# Altium schematic sheet 大号发球机.SchDoc
size A3
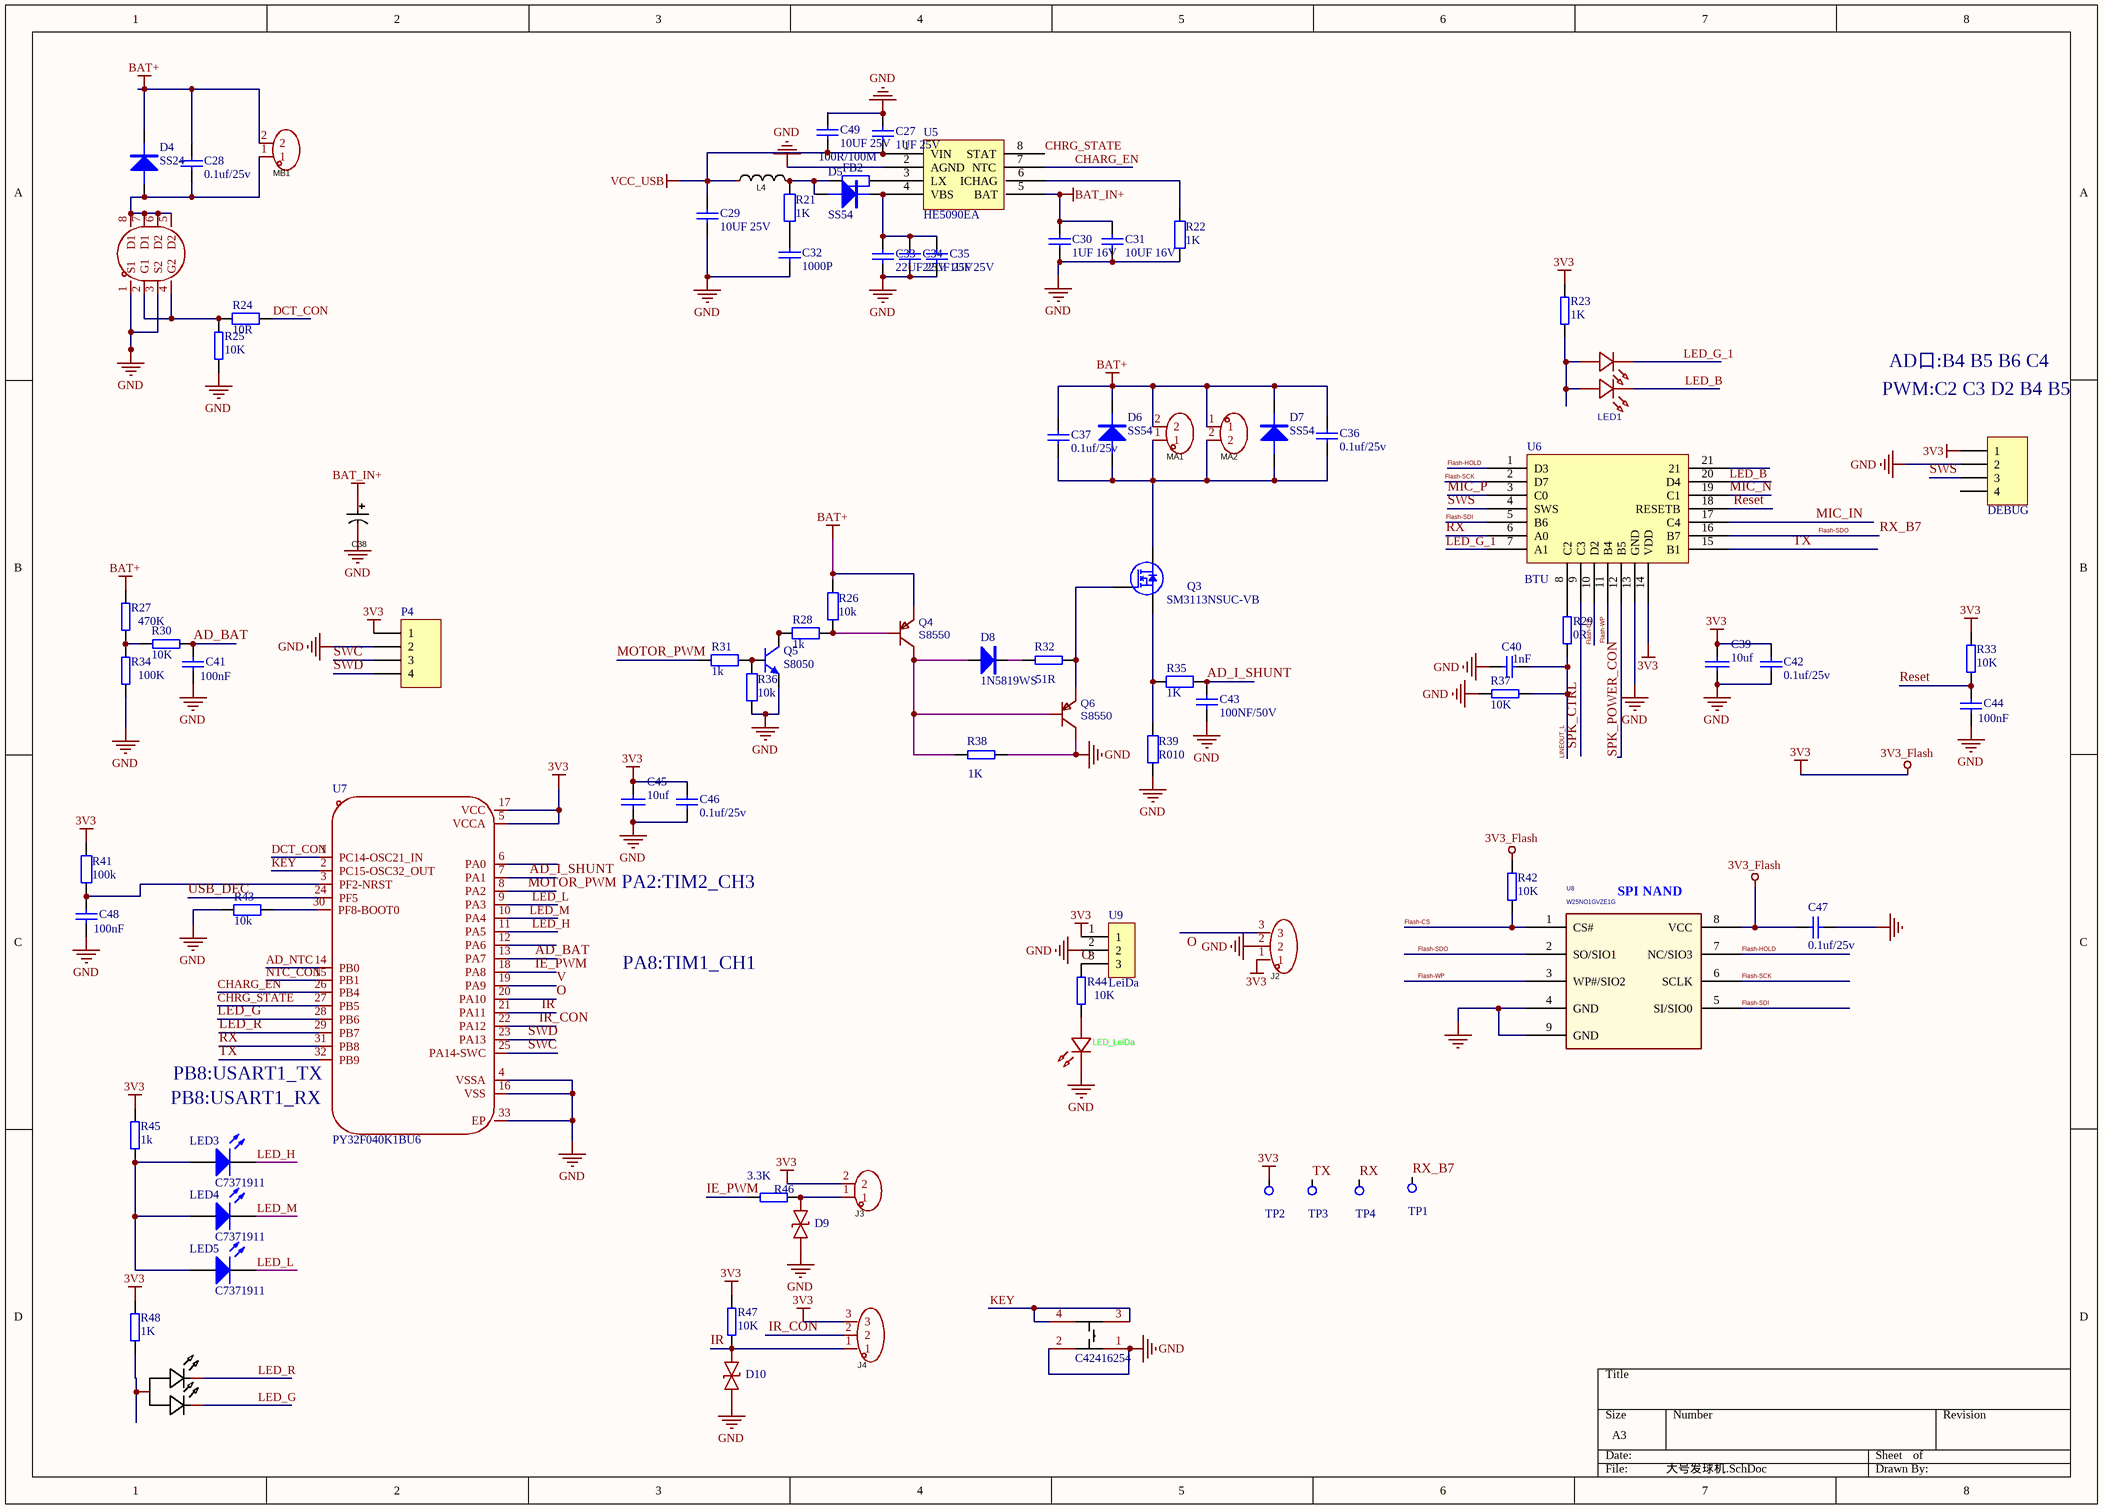
[diagram p0: 大号发球机.SchDoc]

## Parts
C27  1UF 25V  [0603_C]
C28  0.1uf/25v  [0805_C]
C29  10UF 25V  [0603_c]
C30  1UF 16V  [0603_C]
C31  10UF 16V  [0603_c]
C32  1000P  [0603_C]
C33  22UF 25V  [0805_C]
C34  22UF 25V  [0805_C]
C35  1UF 25V  [0603_C]
C36  0.1uf/25v  [0805_C]
C37  0.1uf/25v  [0805_C]
C38  220uf/25v  [SMD 6.3*7.7]  (value not drawn)
C39  10uf  [0603_c]
C40  1nF  [0603_C]
C41  100nF  [0603_C]
C42  0.1uf/25v  [0603_C]
C43  100NF/50V  [0603_C]
C44  100nF  [0603_C]
C45  10uf  [0603_c]
C46  0.1uf/25v  [0603_C]
C47  0.1uf/25v  [0603_C]
C48  100nF  [0603_C]
C49  10UF 25V  [0603_c]
D4  SS24  [SMA]
D5  SS54  [SMA]
D6  SS54  [SMA]
D7  SS54  [SMA]
D8  1N5819WS  [SOD-323]
D9  LESD5Z5.0CT1G  [SOD-523_L1.2-W0.8-LS1.6-RD]  (value not drawn)
D10  LESD5Z5.0CT1G  [SOD-523_L1.2-W0.8-LS1.6-RD]  (value not drawn)
FB2  100R/100M  [0805_R]
J2  2.0-3P LT  [CONN-SMD_2.0-3PLT]  (value not drawn)
J3  2.54-2P LT  [CONN-SMD_2.54-2PLT]  (value not drawn)
J4  2.54-3P LT  [CONN-SMD_2.54-3P-LT]  (value not drawn)
K1  C42416254  [KEY_SMD_4P]
L4  0630-2R2  [L 6.6*7.0]  (value not drawn)
LED1  bl-hb5gk33b-trb  [LED-SMD_4P-L3.2-W2.7-P1.40-TL_BL-HB5GK33B-TRB]  (value not drawn)
LED2  LED_LeiDa  [0805_LED]
LED3  C7371911  [0805_LED]
LED4  C7371911  [0805_LED]
LED5  C7371911  [0805_LED]
LED6  C5221230  [LED-SMD_4P-L3.2-W1.6-TL_XL-3216SURUGC]  (value not drawn)
MA1  2.54-2P LT  [CONN-SMD_2.54-2PLT]  (value not drawn)
MA2  2.54-2P LT  [CONN-SMD_2.54-2PLT]  (value not drawn)
MB1  2.54-2P LT  [CONN-SMD_2.54-2PLT]  (value not drawn)
P3  DEBUG  [SIP4-2.54]
P4  (no value)  [4P 2.0]
Q2  AP9926  [SOP8]  (value not drawn)
Q3  SM3113NSUC-VB  [TO-252]
Q4  S8550  [SOT-23]
Q5  S8050  [SOT-23(SOT-23-3)]
Q6  S8550  [SOT-23]
R21  1K  [0603_R]
R22  1K  [0603_R]
R23  1K  [0603_R]
R24  10R  [0603_R]
R25  10K  [0603_R]
R26  10k  [0603_R]
R27  470K  [0603_R]
R28  1k  [0603_R]
R29  0R  [0603_R]
R30  10K  [0603_R]
R31  1k  [0603_R]
R32  51R  [0603_R]
R33  10K  [0603_R]
R34  100K  [0603_R]
R35  1K  [0603_R]
R36  10k  [0603_R]
R37  10K  [0603_R]
R38  1K  [0603_R]
R39  R010  [2512_R]
R41  100k  [0603_R]
R42  10K  [0603_R]
R43  10k  [0603_R]
R44  10K  [0603_R]
R45  1k  [0603_r]
R46  3.3K  [0603_R]
R47  10K  [0603_R]
R48  1K  [0603_R]
TP1  (no value)  [TP]
TP2  (no value)  [TP]
TP3  (no value)  [TP]
TP4  (no value)  [TP]
U5  HE5090EA  [SOP8-9]
U6  BTU  [BTU]
U7  PY32F040K1BU6  [QFN-32_L5.0-W5.0-P0.50-BL-EP3.4]
U8  W25NO1GVZE1G  [SOP8-150+208]
U9  LeiDa  [5.8G]

## Nets
3V3: C39.2 C42.1 C45.2 C46.1 C47.1 J2.1 J3.2 J4.3 P3.1 P4.1 R23.1 R33.1 R41.1 R42.2 R45.1 R47.2 R48.1 TP2.1 U6.14(VDD) U7.5(VCCA) U7.17(VCC) U8.8(VCC) U9.1  [also labelled 3V3_Flash]
BAT+: C28.2 C36.2 C37.2 D4.2(K) D6.2(K) D7.2(K) MA1.2 MA2.1 MB1.2 Q4.2(E) R26.2 R27.1
BAT_IN+: C30.2 C31.1 C38.1 U5.5(BAT)
GND: C27.2 C29.2 C30.1 C31.2 C32.1 C33.1 C34.1 C35.1 C38.2 C39.1 C40.2 C41.1 C42.2 C43.2 C44.1 C45.1 C46.2 C47.2 C48.1 C49.1 D9.1 D10.1 J2.2 K1.1 K1.2 LED2.2(K) P3.2 P4.2 Q2.1(S1) Q2.3(S2) Q5.2(E) Q6.3(C) R22.2 R25.1 R34.2 R36.1 R37.1 R38.1 R39.1 R43.2 U5.2(AGND) U6.13(GND) U7.4(VSSA) U7.16(VSS) U7.33(EP) U8.4(GND) U8.9(GND) U9.2
VCC_USB: C27.1 C29.1 C49.2 L4.1 U5.1(VIN)
AD_BAT: C41.2 R30.2 U7.13(PA7)
AD_I_SHUNT: C43.1 R35.1 U7.7(PA1)
AD_NTC: U7.14(PB0)
CHARG_EN: U5.7(NTC) U7.26(PB4)
CHRG_STATE: U5.8(STAT) U7.27(PB5)
DCT_CON: R24.1 U7.1(PC14-OSC21_IN)
Flash-CS: R42.1 U6.10(D2) U8.1(CS#)
Flash-HOLD: U6.1(D3) U8.7(NC/SIO3)
Flash-SCK: U6.2(D7) U8.6(SCLK)
Flash-SDI: U6.5(B6) U8.5(SI/SIO0)
Flash-SDO: TP1.1 U6.16(B7) U8.2(SO/SIO1)  [also labelled RX_B7]
Flash-WP: U6.11(B4) U8.3(WP#/SIO2)
IE_PWM: R46.1 U7.18(PA8)
IR: D10.2 J4.1 R47.1 U7.21(PA11)
IR_CON: J4.2 U7.22(PA12)
KEY: K1.3 K1.4 U7.2(PC15-OSC32_OUT)
LED_B: LED1.1(C) U6.20(D4)
LED_G: LED6.3(-) U7.28(PB6)
LED_G_1: LED1.2(C) U6.7(A1)
LED_H: LED3.2(K) U7.11(PA5)
LED_L: LED5.2(K) U7.9(PA3)
LED_M: LED4.2(K) U7.10(PA4)
LED_R: LED6.1(-) U7.29(PB7)
LINEOUT_L: C40.1 R29.1 R37.2
MIC_IN: U6.17(C4)
MIC_N: U6.19(C1)
MIC_P: U6.3(C0)
MOTOR_PWM: R31.1 U7.8(PA2)
NTC_CON: U7.15(PB1)
O: J2.3 R44.1 U7.20(PA10) U9.3
Reset: C44.2 R33.2 U6.18(RESETB)
RX: TP4.1 U6.6(A0) U7.31(PB8)
SPK_CTRL: U6.9(C3)
SPK_POWER_CON: U6.12(B5)
SWC: P4.3 U7.25(PA14-SWC)
SWD: P4.4 U7.23(PA13)
SWS: P3.3 U6.4(SWS)
TX: TP3.1 U6.15(B1) U7.32(PB9)
USB_DEC: U7.24(PF5)
V: U7.19(PA9)
NetC28_1: C28.1 D4.1(A) MB1.1 Q2.5(D2) Q2.6(D2) Q2.7(D1) Q2.8(D1)
NetC32_2: C32.2 R21.2
NetC33_2: C33.2 C34.2 C35.2 D5.2(K) U5.4(VBS)
NetC36_1: C36.1 C37.1 D6.1(A) D7.1(A) MA1.1 MA2.2 Q3.2(D)
NetC48_2: C48.2 R41.2 U7.3(PF2-NRST)
NetD5_1: D5.1(A) FB2.2 L4.2 R21.1
NetD8_1: D8.1(A) Q4.3(C) Q6.1(B) R38.2
NetD8_2: D8.2(K) R32.2
NetD9_2: D9.2 J3.1 R46.2
NetFB2_1: FB2.1 U5.3(LX)
NetLED1_3: LED1.3(A) LED1.4(A) R23.2
NetLED2_1: LED2.1(A) R44.2
NetLED3_1: LED3.1(A) LED4.1(A) LED5.1(A) R45.2
NetLED6_2: LED6.2(+) R48.2
NetQ2_2: Q2.2(G1) Q2.4(G2) R24.2 R25.2
NetQ3_1: Q3.1(G) Q6.2(E) R32.1
NetQ3_3: Q3.3(S) R35.2 R39.2
NetQ4_1: Q4.1(B) R26.1 R28.2
NetQ5_1: Q5.1(B) R31.2 R36.2
NetQ5_3: Q5.3(C) R28.1
NetR22_1: R22.1 U5.6(ICHAG)
NetR27_2: R27.2 R30.1 R34.1
NetR29_2: R29.2 U6.8(C2)
NetR43_1: R43.1 U7.30(PF8-BOOT0)

Not connected (* = marked no-connect by the designer): P3 4; U6 21; U7 6(PA0) 12(PA6)

## Notes on the sheet
- AD口:B4 B5 B6 C4
- (near P3) PWM:C2 C3 D2 B4 B5
- PA2:TIM2_CH3
- (near U8) SPI NAND
- PA8:TIM1_CH1
- PB8:USART1_RX
- (near U7) PB8:USART1_TX

## Library data of the parts
C27 C28 C30 C32 C35-C37 C42 C46 C47 = Cap: Capacitor; Value: 10nF; Published: 8-Jun-2000; Revision: July-2002: Re-released for DXP Platform.; Publisher: Altium Limited
C29 C31 C33 C34 C40 C41 C44 C48 C49 = CAP
C38 = RVT1A221M0605_C72494: Symbol: RVT1A221M0605-C72494; Value: 220uF; Add into BOM: yes; Rated Voltage: 10V; Ripple Current: 90mA@120Hz; L: 5.4mm; Device: RVT1A221M0605_C72494; Supplier: LCSC; Manufacturer Part: RVT1A221M0605; Supplier Part: C72494; JLCPCB Part Class: Extended Part; Supplier Footprint: SMD,D6.3xL5.4mm; Datasheet: https://atta.szlcsc.com/upload/public/pdf/source/20170325/1490427950282.pdf; Convert to PCB: yes; Equivalent Series Resistance(ESR): -
C39 C45 = C-0603: C-?-K-0603; CompNAME: 贴片电容; $MaterialClass: Component; $MaterialID: 12063014; CompCLASSIFICATION: ;电子元器件; Comp_Spec: C-104-50V-X7R-M-0603; CompID: 12063014
C43 = Cap1: 无极电容
D4-D7 = D-SS24-SMA: DO214AC; CompNAME: 贴片二极管; $MaterialClass: Component; $MaterialID: 12091090; CompCLASSIFICATION: ;电子元器件; Comp_Spec: D-SS24-SMA-40V-2A-0.5V; CompID: 12091090
D8 = DIODE
D9 D10 = LESD5Z5.0CT1G: Add into BOM: yes; Reverse Stand-Off Voltage (Vrwm): 5V; Maximum Clamping Voltage: 18.6V; Peak Pulse Current (Ipp)@10/1000us: 9.4A; Breakdown Voltage: 5.6V; Type: ESD; Symbol: LESD5Z5.0CT1G; Device: LESD5Z5.0CT1G; Supplier: LCSC; Manufacturer Part: LESD5Z5.0CT1G; Supplier Part: C136167; Supplier Footprint: SOD-523; Datasheet: https://atta.szlcsc.com/upload/public/pdf/source/20171026/C136167_15089841930291059137.pdf; Convert to PCB: yes
FB2 R21 R22 R24 R26 R28 R31 R35 R36 R39 R41 R43 = Res2: Resistor; Value: 120R; Published: 8-Jun-2000; LatestRevisionDate: 17-Jul-2002; LatestRevisionNote: Re-released for DXP Platform.; PackageReference: AXIAL-0.4; Publisher: Altium Limited
J2 J4 = BX-PH2.0-3PZZ: Add into BOM: yes; Pins Structure: 1x3P; Pitch: 2mm; Reference Series: PH; Number of PINs Per Row: 3; Current Rating (Max): 2A; Symbol: BX-PH2.0-3PZZ; Device: BX-PH2.0-3PZZ; LCSC Part Name: BX-PH2.0-3PZZ; Supplier Part: C18077745; Manufacturer Part: BX-PH2.0-3PZZ; JLCPCB Part Class: Extended Part; Datasheet: https://atta.szlcsc.com/upload/public/pdf/source/20231017/78B49E88B01779D5C268ECAB29020769.pdf; Supplier: LCSC; Convert to PCB: yes; Number of Pins: 3P; Number of Rows: 1; Row Spacing: -; Comment_1: BX-PH2.0-3PZZ
J3 MA1 MA2 MB1 = BX-PH2.0-2PZZ: Add into BOM: yes; Pins Structure: 1x2P; Pitch: 2mm; Reference Series: PH; Number of PINs Per Row: 2; Current Rating (Max): 2A; Symbol: BX-PH2.0-2PZZ; Device: BX-PH2.0-2PZZ; LCSC Part Name: BX-PH2.0-2PZZ; Supplier Part: C18077744; Manufacturer Part: BX-PH2.0-2PZZ; JLCPCB Part Class: Extended Part; Datasheet: https://atta.szlcsc.com/upload/public/pdf/source/20231017/0F5D8A357D6F7BFB4F7225D5BDBA6EB1.pdf; Supplier: LCSC; Convert to PCB: yes; Number of Pins: 2P; Number of Rows: 1; Row Spacing: -; Comment_1: BX-PH2.0-2PZZ
K1 = TS-1002S-05026C: Add into BOM: yes; Switch Length: 6mm; Switch Height: 5mm; Contact Current: 50mA; Voltage Rating (DC): 12V; Symbol: TS-1002S-05026C; Device: TS-1002S-05026C; Supplier: LCSC; Supplier Part: C455110; Manufacturer Part: TS-1002S-05026C; JLCPCB Part Class: Extended Part; Supplier Footprint: SMD,6x6mm; Datasheet: https://atta.szlcsc.com/upload/public/pdf/source/20191118/C455126_F61E8FA1ED640FB1CE0B30B55DEB62E3.pdf; Convert to PCB: yes; Switch Width: 6mm; With Lamp: -; Mechanical Life: -
L4 = FXL0630-4R7-M: Name: 4.7uH; Add into BOM: yes; Value: 4.7uH; Rated Current: 6A; Saturation Current (Isat): 9A; Symbol: FXL0630-4R7-M; Device: FXL0630-4R7-M; Supplier Part: C167220; Manufacturer Part: FXL0630-4R7-M; Supplier Footprint: SMD,6.6x7mm; JLCPCB Part Class: Extended Part; Datasheet: https://atta.szlcsc.com/upload/public/pdf/source/20230516/3A080F5AF8C87BB81C3BA86E5F60E51A.pdf; Supplier: LCSC; Convert to PCB: yes
LED1 = bl-hb5gk33b-trb: AddInBom: yes; ModelId: 9048ebfe7a0846e2b72f9c6251ef3e7d; ModelTransform: 126.063,106.299,0,0,0,0,0,0,0; Power(Watts): 70mW; Forward Current: 5mA; Symbol: BL-HB5GK33B-TRB; SupplierPart: C5123686; ManufacturerPart: BL-HB5GK33B-TRB; Supplier Footprint: SMD-4P,3.2x2.7mm; JLCPCB Part Class: Extended Part; Datasheet: https://item.szlcsc.com/datasheet/BL-HB5GK33B-TRB/5717933.html; Supplier: LCSC; ConvertToPcb: yes; FootprintName: LED-SMD_4P-L3.2-W2.7-P1.40-TL_BL-HB5GK33B-TRB; ModelName: LED-SMD_4P-L3.2-W2.7-P1.40-TL_BL-HB5GK33B-TRB; Lamp Holder Type: -; Color Temperature: -
LED2 = XL-2012SURC: Add into BOM: yes; Power Dissipation: 55mW; Forward Current: 25mA; Dominant Wavelength: 617nm~621nm; Peak Wavelength: 623nm; Symbol: XL-2012SURC; Device: XL-2012SURC; LCSC Part Name: XL-2012SURC; Supplier Part: C965812; Manufacturer Part: XL-2012SURC; Supplier Footprint: 0805; JLCPCB Part Class: Extended Part; Datasheet: https://atta.szlcsc.com/upload/public/pdf/source/20221102/49E1A0A365644091E6270AF1C5E0FE37.pdf; Supplier: LCSC; Convert to PCB: yes; Color Temperature: -
LED3-LED5 = LED0: Typical INFRARED GaAs LED; Published: 8-Jun-2000; LatestRevisionDate: 08-Jul-2005; LatestRevisionNote: Mech Layer 1 removed.; PackageReference: LED-0; Publisher: Altium Limited; PackageDescription: LED; 2 Leads
LED6 = TZ-LAMP03RG4HD-A: Add into BOM: yes; Forward Current: 20mA; Name: TZ-LAMP03RG4HD-A; Symbol: TZ-LAMP03RG4HD-A; Device: TZ-LAMP03RG4HD-A; Supplier Part: C779416; Manufacturer Part: TZ-LAMP03RG4HD-A; JLCPCB Part Class: Extended Part; Datasheet: https://atta.szlcsc.com/upload/public/pdf/source/20200925/C779416_1E8D5F31E629768BCB5A2ABC683FAA82.pdf; Supplier: LCSC; Convert to PCB: yes; Peak Wavelength: -; Lens Color: -; Color Temperature: -; Mounting Sytle: -
P3 P4 = Header 4: Header, 4-Pin; LatestRevisionDate: 17-Jul-2002; LatestRevisionNote: Re-released for DXP Platform.; Publisher: Altium Limited
Q2 = WSP9936: Manufacturer: WINSOK(微硕); Add into BOM: yes; Type: 2个N沟道; Drain Source Voltage (Vdss): 20V; Continuous Drain Current (Id): 8A; Drain Source On Resistance (RDS(on)@Vgs,Id): 14mΩ@4.5V,8A; Power Dissipation (Pd): 2W; Gate Threshold Voltage (Vgs(th)@Id): 750mV@250uA; Total Gate Charge (Qg@Vgs): 17nC@4.5V; Input Capacitance (Ciss@Vds): 520pF@10V; Reverse Transfer Capacitance (Crss@Vds): 60pF@10V; Symbol: WSP9936; Device: WSP9936; LCSC Part Name: 双N沟道MOSFET,电流:8A,耐压:20V; Supplier Part: C2758438; Manufacturer Part: WSP9936; Supplier Footprint: SOP-8; JLCPCB Part Class: Extended Part; Datasheet: https://atta.szlcsc.com/upload/public/pdf/source/20210312/C2758438_9AB8EC3FE3457B5FFF0ECD24924D548D.pdf; Supplier: LCSC; Convert to PCB: yes; Operating Temperature: -55℃~+150℃
Q3 = NMOS1: N沟道MOS管
Q4 Q6 = S8550_C545533: BOM_Manufacturer: UMW(Youtai Semiconductor Co., Ltd.); Contributor: LCSC; BOM_Supplier: LCSC; BOM_Supplier Part: C545533; BOM_Manufacturer Part: S8550; BOM_JLCPCB Part Class: Extended Part; spicePre: Q; spiceSymbolName: S8550_C545533
Q5 = NPN_sot23: NPN三极管
R23 R25 R27 R29 R30 R32-R34 R37 R38 R42 R44-R48 = RES
TP1-TP4 = J-CSD
U8 = 24C08_3
U9 = CON3